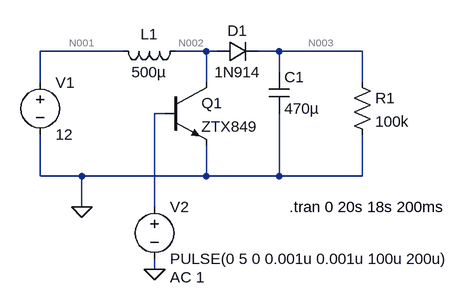
[diagram p0: schematic boost.asc]
boost.asc, the LTspice schematic file:
Version 4
SHEET 1 880 680
WIRE 64 128 -64 128
WIRE 192 128 144 128
WIRE 208 128 192 128
WIRE 304 128 272 128
WIRE 432 128 304 128
WIRE 304 160 304 128
WIRE -64 176 -64 128
WIRE 192 176 192 128
WIRE 432 176 432 128
WIRE 128 224 112 224
WIRE -64 320 -64 256
WIRE 0 320 -64 320
WIRE 192 320 192 272
WIRE 192 320 0 320
WIRE 304 320 304 224
WIRE 304 320 192 320
WIRE 432 320 432 256
WIRE 432 320 304 320
WIRE 0 368 0 320
WIRE 112 368 112 224
WIRE 112 464 112 448
FLAG 0 368 0
FLAG 112 464 0
SYMBOL cap 288 160 R0
SYMATTR InstName C1
SYMATTR Value 470µ
SYMBOL ind 160 112 R90
WINDOW 0 5 56 VBottom 2
WINDOW 3 32 56 VTop 2
SYMATTR InstName L1
SYMATTR Value 500µ
SYMATTR SpiceLine Ipk=0.5 Rser=2
SYMBOL npn 128 176 R0
SYMATTR InstName Q1
SYMATTR Value ZTX849
SYMBOL diode 208 144 R270
WINDOW 0 32 32 VTop 2
WINDOW 3 0 32 VBottom 2
SYMATTR InstName D1
SYMATTR Value 1N914
SYMATTR Description Schottky diode
SYMATTR Type schottky
SYMBOL voltage -64 160 R0
WINDOW 123 0 0 Left 2
WINDOW 39 0 0 Left 2
SYMATTR InstName V1
SYMATTR Value 12
SYMBOL voltage 112 352 R0
WINDOW 123 24 124 Left 2
WINDOW 39 0 0 Left 2
SYMATTR Value2 AC 1
SYMATTR InstName V2
SYMATTR Value PULSE(0 5 0 0.001u 0.001u 100u 200u)
SYMBOL res 416 160 R0
SYMATTR InstName R1
SYMATTR Value 100k
TEXT 320 368 Left 2 !.tran 0 20s 18s 200ms

The netlist it stands for:
* boost.asc
C1 N003 0 470µ
L1 N002 N001 500µ Ipk=0.5 Rser=2
Q1 N002 N004 0 0 ZTX849
D1 N002 N003 1N914
V1 N001 0 12
V2 N004 0 PULSE(0 5 0 0.001u 0.001u 100u 200u) AC 1
R1 N003 0 100k
.model D D
.lib standard.dio
.model NPN NPN
.model PNP PNP
.lib standard.bjt
.tran 0 20s 18s 200ms
.backanno
.end

* Results of the author's LTspice run, read from the files saved beside the schematic
* Operating Point, zero values left out:
*   V(n003) = 11.51 V
*   V(n002) = 12 V
*   V(n001) = 12 V
*   Ic(Q1) = 13.26 pA
*   Ib(Q1) = -12.53 pA
*   I(D1) = 115.1 µA
*   I(L1) = -115.1 µA
*   I(R1) = 115.1 µA
*   I(V2) = 12.53 pA
*   I(V1) = -115.1 µA